# Altium schematic sheet Sheet1.SchDoc
size A
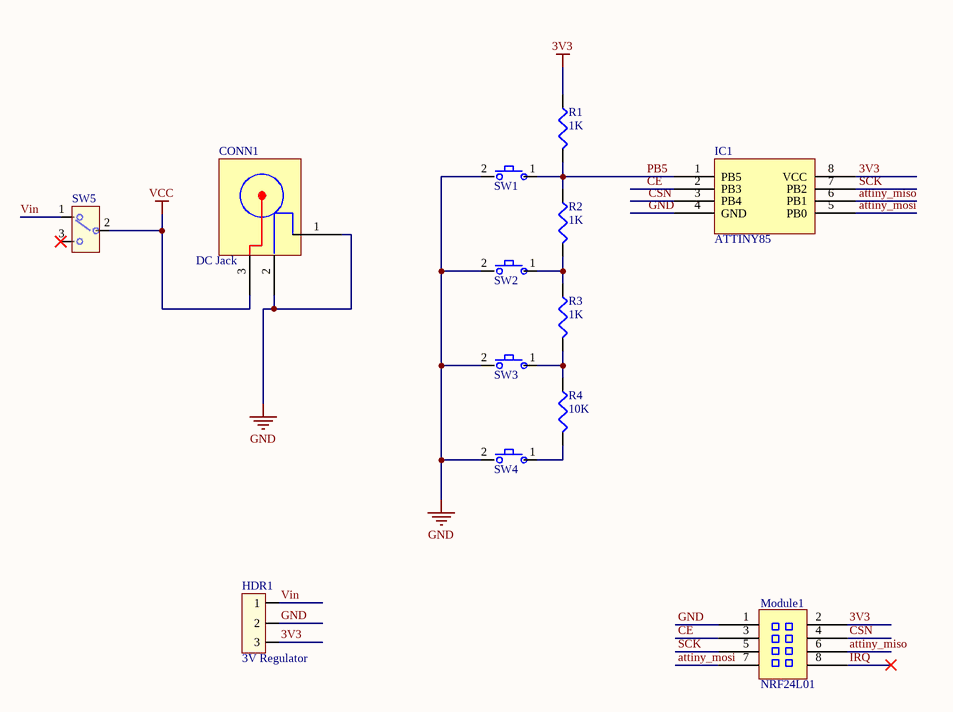
[diagram p0: Sheet1.SchDoc]

## Parts
CONN1  DC Jack  [DC Jack]
HDR1  3V Regulator  [Header3 - SIMPLE]
IC1  ATTINY85  [PDIP-8]
Module1  NRF24L01  [Header8]
R1  1K  [1608[0603]]
R2  1K  [1608[0603]]
R3  1K  [1608[0603]]
R4  10K  [1608[0603]]
SW1  517315R  [Push Button]  (value not drawn)
SW2  517315R  [Push Button]  (value not drawn)
SW3  517315R  [Push Button]  (value not drawn)
SW4  517315R  [Push Button]  (value not drawn)
SW5  600029  [Switch - small]  (value not drawn)

## Nets
3V3: HDR1.3 IC1.8(VCC) Module1.2 R1.1
GND: CONN1.1 CONN1.2 HDR1.2 IC1.4(GND) Module1.1 SW1.2 SW2.2 SW3.2 SW4.2
VCC: CONN1.3 SW5.2
attiny_miso: IC1.6(PB1) Module1.6
attiny_mosi: IC1.5(PB0) Module1.7
CE: IC1.2(PB3) Module1.3
CSN: IC1.3(PB4) Module1.4
IRQ: Module1.8
PB5: IC1.1(PB5) R1.2 R2.1 SW1.1
SCK: IC1.7(PB2) Module1.5
Vin: HDR1.1 SW5.1
NetR2_2: R2.2 R3.1 SW2.1
NetR3_2: R3.2 R4.1 SW3.1
NetR4_2: R4.2 SW4.1

Not connected (* = marked no-connect by the designer): SW5 3*

## Library data of the parts
CONN1 = 600035: CONN, 6mm Hole Size DC Jack
HDR1 = 600032: HDR, Female 3-position
IC1 = 600027: IC, ATTINY85, PDIP-8
Module1 = 600030: Module, Female HDR 8-Position
R1-R4 = 600002: RES, Through Hole, 10K Ohm, ±1%, 1/2W; Resistance: 10K Ohm; Value: 10000 Ohm; Tolerance: ±1%; Package: Through Hole; Rated Power/Power Dissipation: 1/2W; Type: Thick Film Chip
SW1-SW4 = 517315R: SW, NKKAB11AH-RO
SW5 = 600029: SW, Small, Through Hole SPDT Switch